# EAGLE design Dash LEDs r3 (EAGLE 8.4.1)
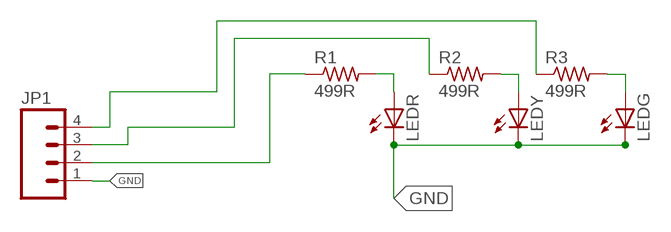
[diagram p0: schematic, sheet 1]

## Parts
JP1  M04PTH  [1X04]
LEDG  LED5MM  [LED5MM]
LEDR  LED5MM  [LED5MM]
LEDY  LED5MM  [LED5MM]
R1  499R  R-US_R0805  [R0805]
R2  499R  R-US_R0805  [R0805]
R3  499R  R-US_R0805  [R0805]

## Nets
DRV1: JP1.2 R1.1
DRV2: JP1.3 R2.1
DRV3: JP1.4 R3.1
GND: JP1.1 LEDG.K(C) LEDR.K(C) LEDY.K(C)
N$1: LEDR.A R1.2
N$2: LEDY.A R2.2
N$3: LEDG.A R3.2

## Library data of the parts
JP1 = SparkFun-Connectors:M04: Header 4 Standard 4-pin 0.1" header. Use with straight break away headers (SKU : PRT-00116), right angle break away headers (PRT-00553), swiss pins (PRT-00743), machine pins (PRT-00117), and female headers (PRT-00115). Molex polarized connector foot print use with SKU : PRT-08231 with associated crimp pins and housings. 1MM SMD Version SKU: PRT-10208
LEDG LEDR LEDY = led:LED: LED OSRAM: - CHIPLED LG R971, LG N971, LY N971, LG Q971, LY Q971, LO R971, LY R971 LH N974, LH R974 LS Q976, LO Q976, LY Q976 LO Q996 - Hyper CHIPLED LW Q18S LB Q993, LB Q99A, LB R99A - SideLED LS A670, LO A670, LY A670, LG A670, LP A670 LB A673, LV A673, LT A673, LW A673 LH A674 LY A675 LS A676, LA A676, LO A676, LY A676, LW A676 LS A679, LY A679, LG A679 - Hyper Micro SIDELED® LS Y876, LA Y876, LO Y876, LY Y876 LT Y87S - SmartLED LW L88C, LW L88S LB L89C, LB L89S, LG L890 LS L89K, LO L89K, LY L89K LS L896, LA L896, LO L896, LY L896 - TOPLED LS T670, LO T670, LY T670, LG T670, LP T670 LSG T670, LSP T670, LSY T670, LOP T670, LYG T670 LG T671, LOG T671, LSG T671 LB T673, LV T673, LT T673, LW T673 LH T674 LS T676, LA T676, LO T676, LY T676, LB T676, LH T676, LSB T676, LW T676 LB T67C, LV T67C, LT T67C, LS T67K, LO T67K, LY T67K, LW E67C LS E67B, LA E67B, LO E67B, LY E67B, LB E67C, LV E67C, LT E67C LW T67C LS T679, LY T679, LG T679 LS T770, LO T770, LY T770, LG T770, LP T770 LB T773, LV T773, LT T773, LW T773 LH T774 LS E675, LA E675, LY E675, LS T675 LS T776, LA T776, LO T776, LY T776, LB T776 LHGB T686 LT T68C, LB T68C - Hyper Mini TOPLED® LB M676 - Mini TOPLED Santana® LG M470 LS M47K, LO M47K, LY M47K Source: http://www.osram.convergy.de LUXEON: - LUMILED® LXK2-PW12-R00, LXK2-PW12-S00, LXK2-PW14-U00, LXK2-PW14-V00 LXK2-PM12-R00, LXK2-PM12-S00, LXK2-PM14-U00 LXK2-PE12-Q00, LXK2-PE12-R00, LXK2-PE12-S00, LXK2-PE14-T00, LXK2-PE14-U00 LXK2-PB12-K00, LXK2-PB12-L00, LXK2-PB12-M00, LXK2-PB14-N00, LXK2-PB14-P00, LXK2-PB14-Q00 LXK2-PR12-L00, LXK2-PR12-M00, LXK2-PR14-Q00, LXK2-PR14-R00 LXK2-PD12-Q00, LXK2-PD12-R00, LXK2-PD12-S00 LXK2-PH12-R00, LXK2-PH12-S00 LXK2-PL12-P00, LXK2-PL12-Q00, LXK2-PL12-R00 Source: www.luxeon.com KINGBRIGHT: KA-3528ASYC Source: www.kingbright.com
R1-R3 = resistor:R-US_: RESISTOR, American symbol

## Board
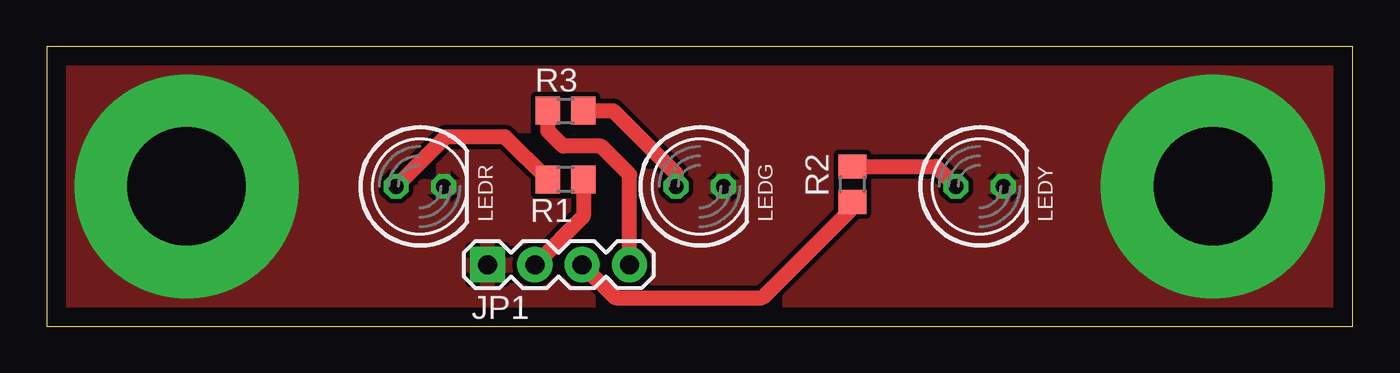
[diagram p1: board, top side]
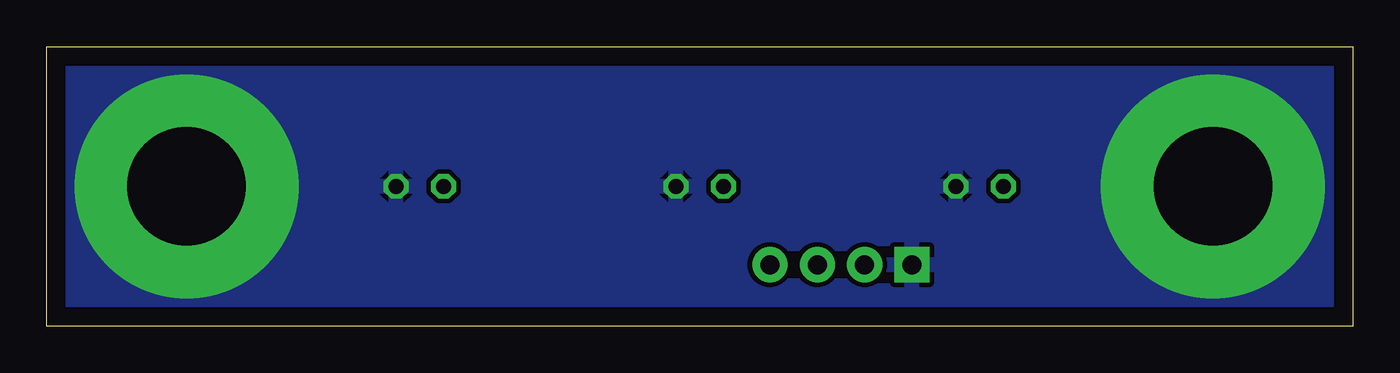
[diagram p2: board, bottom side, seen from below]

Size 70 x 15 mm. Coordinates in mm from the lower left corner, seen from the top.
Outline: 0,0 70,0 70,15 0,15 0,0
Copper layers (1*16): Top 0.035mm / dielectric 1.5mm / Bottom 0.035mm
Design rules "default *": minimum track width 6mil, minimum drill 0.35mm, track to track 8mil, track to pad 8mil, pad to pad 8mil, via to via 8mil, smd to smd 8mil, copper to edge 40mil, drill to drill 6mil, minimum pad ring 10mil, minimum via ring 8mil, stop-mask expansion 4mil, vias tented up to drill 0mil, thermal gap 10mil

### Footprints (pad centres in the part's own frame; a part is rotated, then mirrored left to right if it is on the bottom)
1X04 = drill 1.016 pad 1.88 square: 1 0,0 | drill 1.016 pad 1.88: 2 2.54,0; 3 5.08,0; 4 7.62,0
LED5MM = drill 0.813 octagon: A -1.27,0; K 1.27,0
R0805 = smd 1.3 x 1.5: 1 -0.95,0; 2 0.95,0

### Placement (x,y rotation side)
JP1  23.62,3.3 0 top
LEDG  35,7.5 0 top
LEDR  20,7.5 0 top
LEDY  50,7.5 0 top
R1  27.81,7.87 180 top
R2  43.18,7.62 90 top
R3  27.81,11.56 0 top

### Tracks (layer width: path | path; a pad name or v marks a point on that pad's centre or on a via)
DRV1
  Top 0.813: R1.1 28.76,5.9 JP1.2
DRV2
  Top 0.813: JP1.3 30.48,1.52 38.35,1.52 43.18,6.35 R2.1
DRV3
  Top 0.813: JP1.4 31.24,8.13 29.72,9.65 27.69,9.65 26.86,10.47 R3.1
GND  (via drill 6.35 pad 12)
  other vias: 7.5,7.5 62.5,7.5
  pour Bottom (isolate 0.254): -1.27,16.51 71.12,16.51 71.12,12.7 71.12,-1.27 29.21,-1.27 -1.27,-1.27
  pour Top (isolate 0.254): -1.27,11.43 -1.27,16.51 2.54,16.51 71.12,16.51 71.12,7.62 71.12,-1.27 1.27,-1.27 -1.27,-1.27
N$1
  Top 0.813: R1.2 24.58,10.16 21.39,10.16 LEDR.A
N$2
  Top 0.813: R2.2 47.66,8.57 LEDY.A
N$3
  Top 0.813: R3.2 30.35,11.56 33.73,8.18 LEDG.A